# Altium schematic sheet [06] Keypad.SchDoc: Design 1
size Tabloid; Engineer: The ASID Designer; Organization: ASID Designer; Address1: Iran; Address2: Shiraz; Address3: P.O.Box 71765-385; DocumentNumber: 1; Revision: 1.0; SheetNumber: 1; SheetTotal: 1
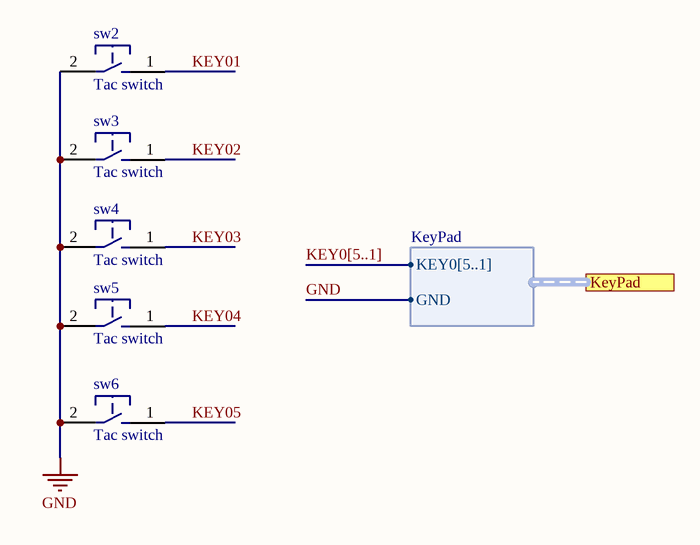
[diagram p0: [06] Keypad.SchDoc]

## Parts
sw2  Tac switch  [MY_PB-SMD]
sw3  Tac switch  [MY_PB-SMD]
sw4  Tac switch  [MY_PB-SMD]
sw5  Tac switch  [MY_PB-SMD]
sw6  Tac switch  [MY_PB-SMD]

## Ports
KeyPad (harness KeyPad)

## Harnesses
KeyPad: GND, KEY0[5..1]

## Nets
GND: sw2.2 sw3.2 sw4.2 sw5.2 sw6.2 ; port KeyPad.GND
KEY01: sw2.1
KEY02: sw3.1
KEY03: sw4.1
KEY04: sw5.1
KEY05: sw6.1

## Buses and harness runs
bus KEY0[5..1]

## Notes on the sheet
- Title
- Engineer:
- Date:
- Ali Asadzadeh
- Time:
- Number:
- Sheet
- Revision:
- of
- www.ASiDesigner.com
- Designed In Shiraz
- ASiD Designer
- File:

## Library data of the parts
sw2-sw6 = Tac switch: small tac switch; ASiD Part Number: Tac switch-AS